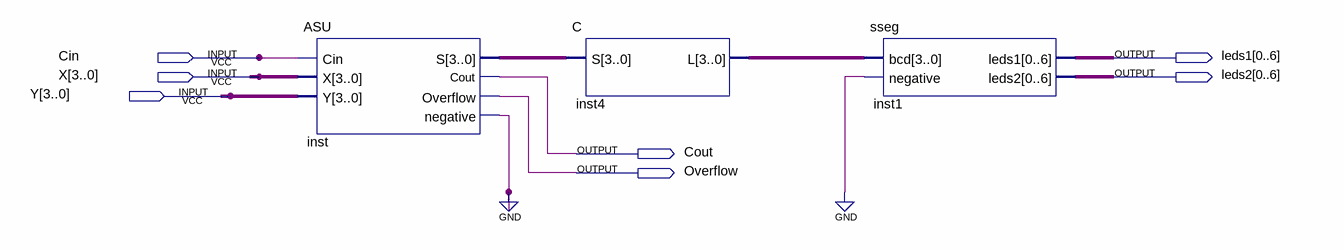
[diagram p0: schematic sheet]
// Quartus schematic lab3_partB_mix.bdf as structural Verilog: 3 symbols, 7 pins
module lab3_partB_mix (
  input  Cin,
  input  [3:0] X,
  input  [3:0] Y,
  output [0:6] leds1,
  output [0:6] leds2,
  output Cout,
  output Overflow
);

  wire inst_negative;
  wire [3:0] inst4_l, inst_s;

  ASU inst (.Cin(Cin), .X(X), .Y(Y), .S(inst_s), .Cout(Cout), .Overflow(Overflow), .negative(inst_negative));
  C inst4 (.S(inst_s), .L(inst4_l));
  sseg inst1 (.bcd(inst4_l), .negative(1'b0), .leds1(leds1), .leds2(leds2));
  // also tied to GND on the sheet: inst_negative
endmodule
